# Altium schematic sheet LM555.SchDoc
size A
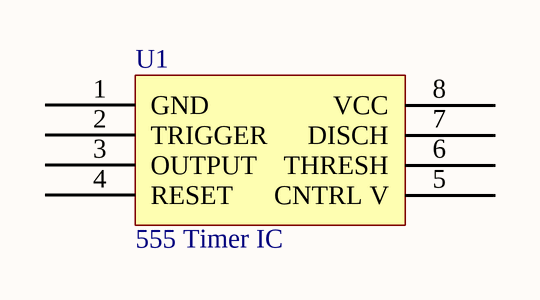
[diagram p0: LM555.SchDoc]

## Parts
U1  555 Timer IC  [LM555]

## Nets

Not connected (* = marked no-connect by the designer): U1 1(GND) 2(TRIGGER) 3(OUTPUT) 4(RESET) 5(CNTRL_V) 6(THRESH) 7(DISCH) 8(VCC)

## Library data of the parts
U1 = LM555CM: TEXAS INSTRUMENTS         LM555CM            IC, TIMER, SMD, SOIC8, 555; Manufacturer: TI National Semiconductor; Min Supply Voltage: 4.5V; Max Supply Voltage: 16V; Max Power Dissipation: 1.18W; Number of Timers/Counters: 1; High Level Output Current: -200mA; Low Level Output Current: 200mA; Frequency: 100kHz; Nominal Supply Current: 3mA; Operating Supply Current: 10mA; Supplier 1: Mouser; Manufacturer Part Number: LM555CM; RoHS: Yes; Category: Timers and Oscillators; Pricing 1: 665=0.99400, 1045=0.82400, 2565=0.76700, 5035=0.73900, 10070=0.71000 (USD); Mount: Surface Mount; Case/Package: SOIC; Number of Pins: 8; Contact Plating: Tin,Lead; Min Operating Temperature: 0°C; Max Operating Temperature: 70°C; Packaging: Rail/Tube; Power Dissipation: 1.18W; Package Quantity: 95; Current Rating: 3mA; Quiescent Current: 3mA; Output Current: 200mA; Number of Channels: 1; Radiation Hardening: No; Lead Free: Lead Free; REACH SVHC: No SVHC; ComponentLink1URL: https://datasheet.ciiva.com/1592/1767362-1592763.pdf?src-supplier=Newark; ComponentLink1Description: https://datasheet.ciiva.com/1592/1767362-1592763.pdf?src-supplier=Newark; ComponentLink2URL: https://datasheet.ciiva.com/1139/1896155-1139384.pdf?src-supplier=Element14; ComponentLink2Description: https://datasheet.ciiva.com/1139/1896155-1139384.pdf?src-supplier=Element14; Supplier Part Number 1: 926-LM555CM